# Altium schematic sheet [07] Communication.SchDoc
size A3
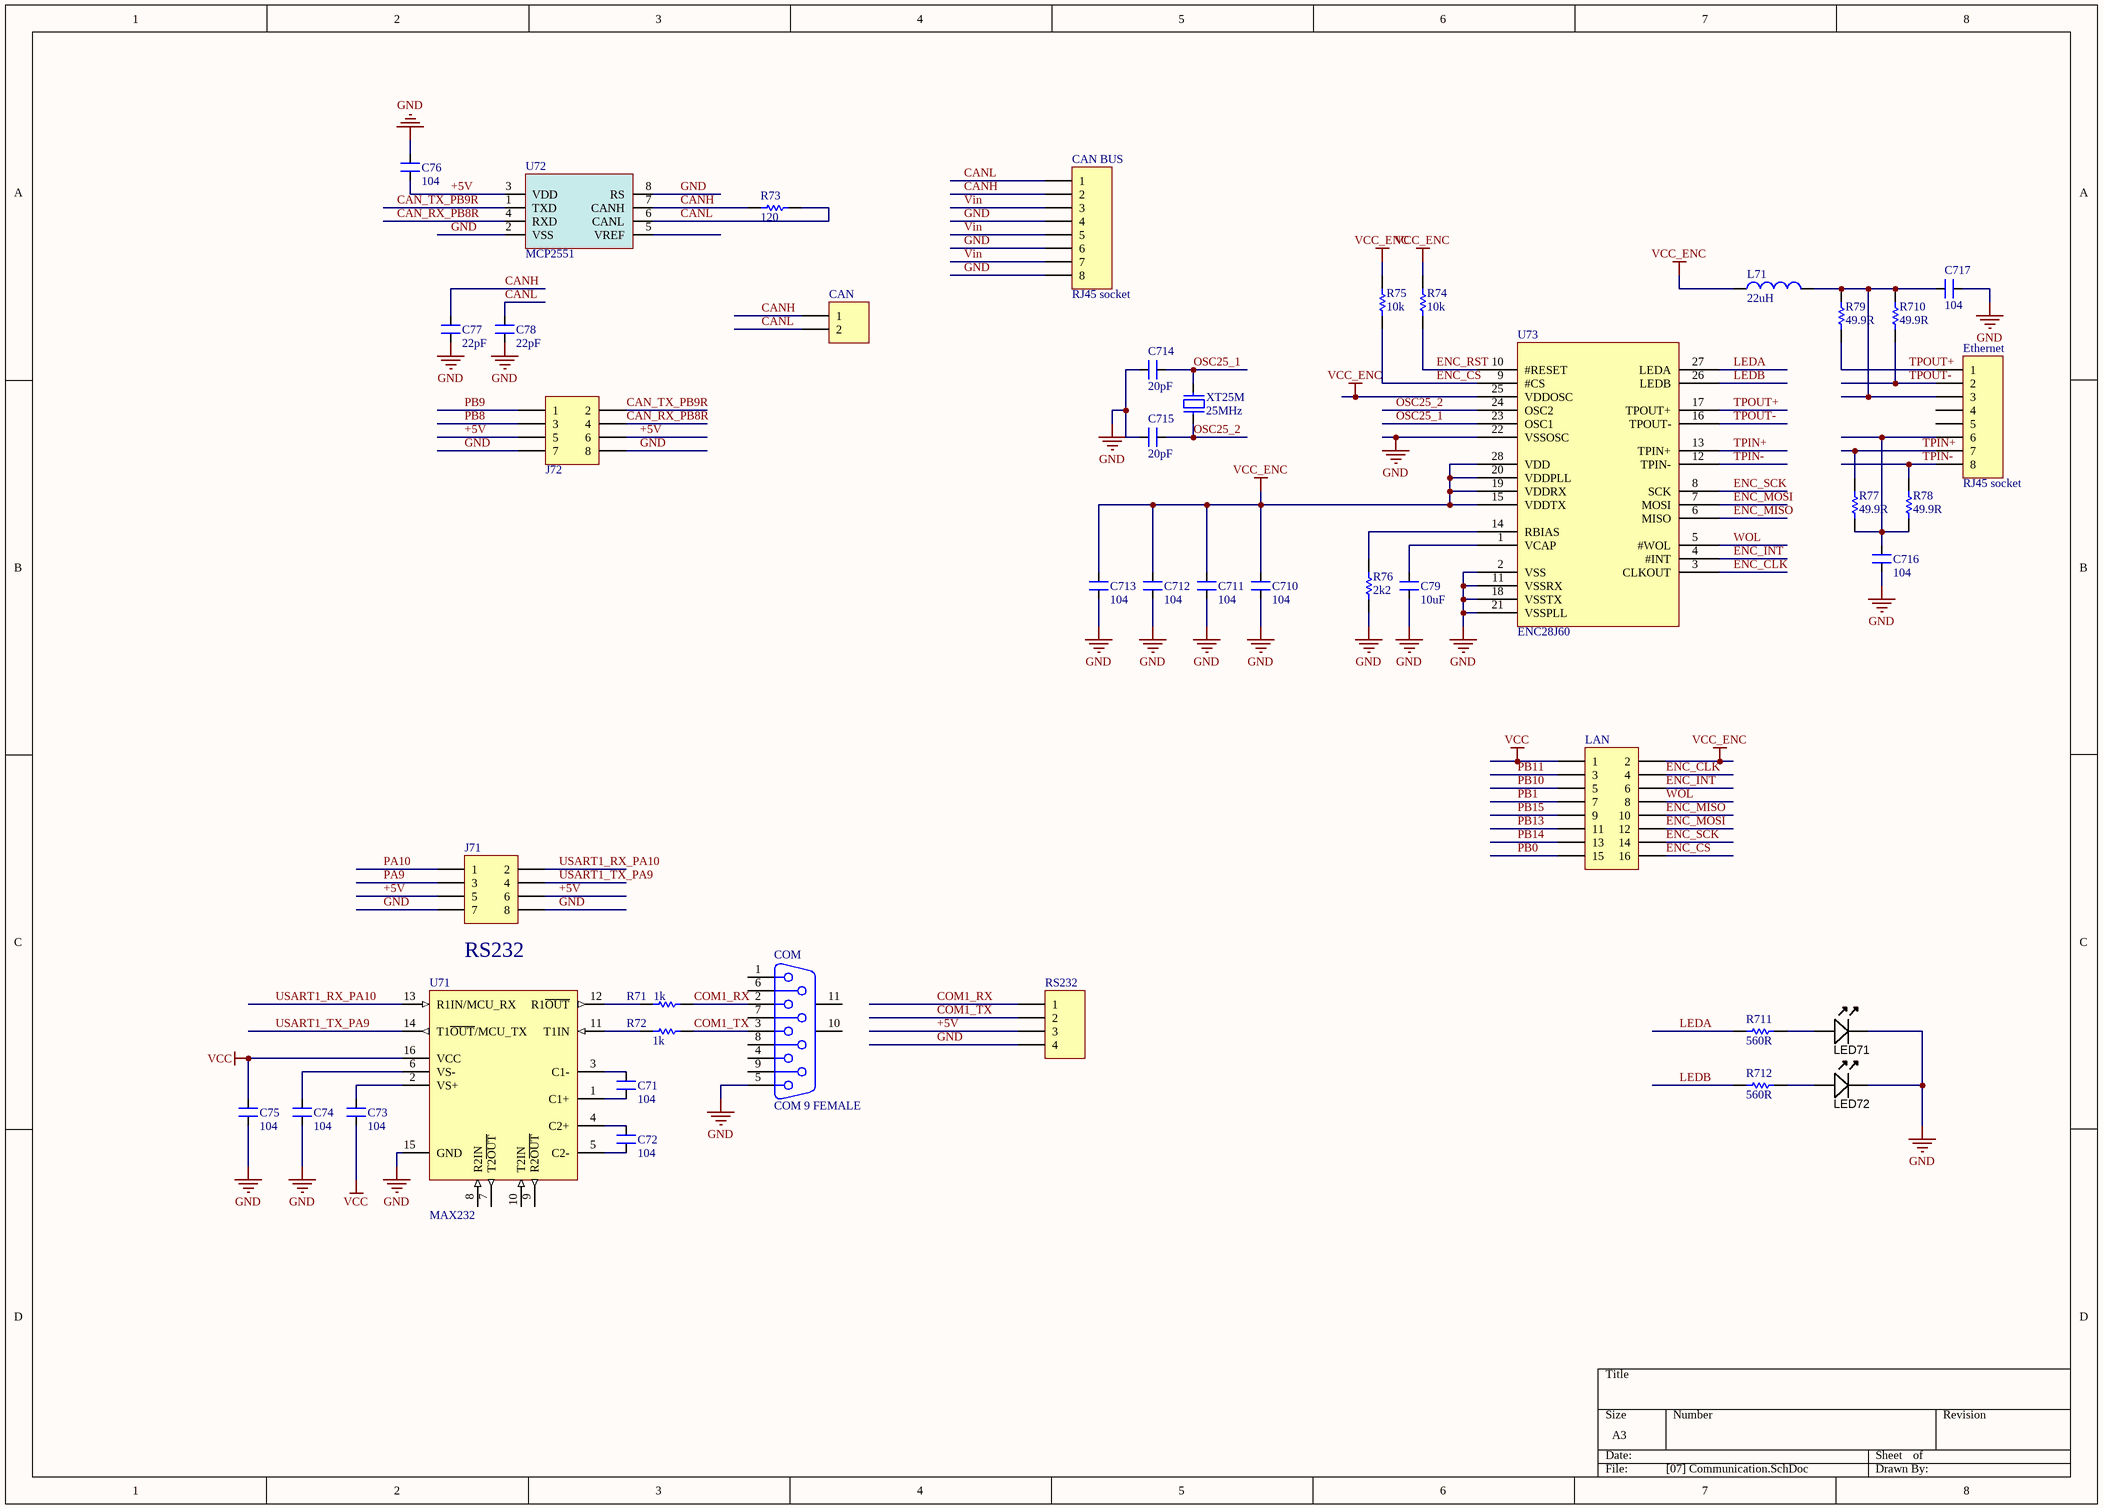
[diagram p0: [07] Communication.SchDoc]

## Parts
C71  value 104  [CAPC2012N_F]  (hidden comment: Cap_1206_104)
C72  value 104  [CAPC2012N_F]  (hidden comment: Cap_1206_104)
C73  value 104  [CAPC2012N_F]  (hidden comment: Cap_1206_104)
C74  value 104  [CAPC2012N_F]  (hidden comment: Cap_1206_104)
C75  value 104  [CAPC2012N_F]  (hidden comment: Cap_1206_104)
C76  value 104  [CAPC2012N_F]  (hidden comment: Cap_10uF_0805)
C77  value 22pF  [CAPC1608N]  (hidden comment: Cap_22p_0603)
C78  value 22pF  [CAPC1608N]  (hidden comment: Cap_22p_0603)
C79  value 10uF  [CAPC2012N_F]  (hidden comment: CAP NP)
C710  value 104  [CAPC1608N]  (hidden comment: CAP NP)
C711  value 104  [CAPC1608N]  (hidden comment: CAP NP)
C712  value 104  [CAPC1608N]  (hidden comment: CAP NP)
C713  value 104  [CAPC1608N]  (hidden comment: CAP NP)
C714  value 20pF  [CAPC1608N]  (hidden comment: Cap_22p_0603)
C715  value 20pF  [CAPC1608N]  (hidden comment: Cap_22p_0603)
C716  value 104  [CAPC2012N_F]  (hidden comment: CAP NP)
C717  value 104  [CAPC2012N_F]  (hidden comment: CAP NP)
CAN  Header 2  [HDR1X2]  (value not drawn)
CAN_BUS  RJ45 socket  [RJ45]
COM  COM 9 FEMALE  [DB 9 Female]
Ethernet  RJ45 socket  [RJ45]
J71  Header 4X2  [HDR2X4]  (value not drawn)
J72  Header 4X2  [HDR2X4]  (value not drawn)
L71  value 22uH  [CAPC2012N_F]  (hidden comment: Inductor)
LAN  Header 8X2  [HDR2X8]  (value not drawn)
LED71  Blue  [LED-0805-K]  (value not drawn)
LED72  Blue  [LED-0805-K]  (value not drawn)
R71  1k  [RESC2012N_F]
R72  1k  [RESC2012N_F]
R73  value 120  [RESC2012N_F]  (hidden comment: Res_120_0805)
R74  value 10k  [RESC1608N_ZERO]  (hidden comment: Res)
R75  value 10k  [RESC1608N_ZERO]  (hidden comment: Res)
R76  value 2k2  [RESC1608N_ZERO]  (hidden comment: Res)
R77  value 49.9R  [RESC2012N_F]  (hidden comment: Res)
R78  value 49.9R  [RESC2012N_F]  (hidden comment: Res)
R79  value 49.9R  [RESC2012N_F]  (hidden comment: Res)
R710  value 49.9R  [RESC2012N_F]  (hidden comment: Res)
R711  value 560R  [RESC1608N_ZERO]  (hidden comment: Res)
R712  value 560R  [RESC1608N_ZERO]  (hidden comment: Res)
RS232  Header 4  [HDR1X4]  (value not drawn)
U71  MAX232  [SOIC127P600X175-16AN]
U72  MCP2551  [SOIC 8]
U73  ENC28J60  [SOIC-28]
XT25M  25MHz  [XT2]

## Nets
GND: C74.1 C75.1 C76.1 C77.1 C78.1 C79.1 C710.1 C711.1 C712.1 C713.1 C714.2 C715.2 C716.1 C717.2 CAN_BUS.4 CAN_BUS.6 CAN_BUS.8 COM.5 J71.7 J71.8 J72.7 J72.8 LED71.K LED72.K R76.1 RS232.4 U71.15(GND) U72.2(VSS) U72.8(RS) U73.2(VSS) U73.11(VSSRX) U73.18(VSSTX) U73.21(VSSPLL) U73.22(VSSOSC)
VCC: C73.1 C75.2 LAN.1 U71.16(VCC)
VCC_ENC: C710.2 C711.2 C712.2 C713.2 L71.1 LAN.2 R74.2 R75.2 U73.15(VDDTX) U73.19(VDDRX) U73.20(VDDPLL) U73.25(VDDOSC) U73.28(VDD)
+5V: C76.2 J71.5 J71.6 J72.5 J72.6 RS232.3 U72.3(VDD)
CAN_RX_PB8R: J72.4 U72.4(RXD)
CAN_TX_PB9R: J72.2 U72.1(TXD)
CANH: C77.2 CAN.1 CAN_BUS.2 R73.1 U72.7(CANH)
CANL: C78.2 CAN.2 CAN_BUS.1 R73.2 U72.6(CANL)
COM1_RX: COM.2 R71.2 RS232.1
COM1_TX: COM.3 R72.2 RS232.2
ENC_CLK: LAN.4 U73.3(CLKOUT)
ENC_CS: LAN.16 R75.1 U73.9(#CS)
ENC_INT: LAN.6 U73.4(#INT)
ENC_MISO: LAN.10 U73.6(MISO)
ENC_MOSI: LAN.12 U73.7(MOSI)
ENC_RST: R74.1 U73.10(#RESET)
ENC_SCK: LAN.14 U73.8(SCK)
LEDA: R711.1 U73.27(LEDA)
LEDB: R712.1 U73.26(LEDB)
OSC25_1: C714.1 U73.23(OSC1) XT25M.2
OSC25_2: C715.1 U73.24(OSC2) XT25M.1
PA9: J71.3
PA10: J71.1
PB0: LAN.15
PB1: LAN.7
PB8: J72.3
PB9: J72.1
PB10: LAN.5
PB11: LAN.3
PB13: LAN.11
PB14: LAN.13
PB15: LAN.9
TPIN+: Ethernet.7 R77.2 U73.13(TPIN+)
TPIN-: Ethernet.8 R78.2 U73.12(TPIN-)
TPOUT+: Ethernet.1 R79.1 U73.17(TPOUT+)
TPOUT-: Ethernet.2 R710.1 U73.16(TPOUT-)
USART1_RX_PA10: J71.2 U71.13(R1IN/MCU_RX)
USART1_TX_PA9: J71.4 U71.14(T1~{OUT}/MCU_TX)
Vin: CAN_BUS.3 CAN_BUS.5 CAN_BUS.7
WOL: LAN.8 U73.5(#WOL)
NetC71_1: C71.1 U71.1(C1+)
NetC71_2: C71.2 U71.3(C1-)
NetC72_1: C72.1 U71.5(C2-)
NetC72_2: C72.2 U71.4(C2+)
NetC73_2: C73.2 U71.2(VS+)
NetC74_2: C74.2 U71.6(VS-)
NetC79_2: C79.2 U73.1(VCAP)
NetC716_2: C716.2 Ethernet.6 R77.1 R78.1
NetC717_1: C717.1 Ethernet.3 L71.2 R79.2 R710.2
NetLED71_A: LED71.A R711.2
NetLED72_A: LED72.A R712.2
NetR71_1: R71.1 U71.12(R1~{OUT})
NetR72_1: R72.1 U71.11(T1IN)
NetR76_2: R76.2 U73.14(RBIAS)

Not connected (* = marked no-connect by the designer): COM 1 4 6 7 8 9 10(MH1) 11(MH2); Ethernet 4 5; U71 7(T2~{OUT}) 8(R2IN) 9(R2~{OUT}) 10(T2IN); U72 5(VREF)

## Notes on the sheet
- RS232

## Library data of the parts
C71-C78 C714 C715 = CAP NP
CAN = Header 2: Header, 2-Pin; LatestRevisionDate: 17-Jul-2002; LatestRevisionNote: Re-released for DXP Platform.; Publisher: Altium Limited
CAN_BUS Ethernet = Header 8: Header, 8-Pin; LatestRevisionDate: 17-Jul-2002; LatestRevisionNote: Re-released for DXP Platform.; Publisher: Altium Limited
COM = COM9M: PackageDocument: O; Positions: 9; Gender: Receptacle; Value: COM 9; Published: 15-Jun-2001; LatestRevisionDate: 17-Jul-2002; LatestRevisionNote: Re-released for DXP Platform.; DatasheetDocument: 1-Sep-1999; PackageReference: 788750; Publisher: Altium Limited; Orientation: Right Angle
J71 J72 = Header 4X2: Header, 4-Pin, Dual row; LatestRevisionDate: 17-Jul-2002; LatestRevisionNote: Re-released for DXP Platform.; Publisher: Altium Limited
LAN = Header 8X2: Header, 8-Pin, Dual row; LatestRevisionDate: 17-Jul-2002; LatestRevisionNote: Re-released for DXP Platform.; Publisher: Altium Limited
LED71 LED72 = LED_SMD_Blue_0805_100mcd: LED 0805 SMD Blue 100mcd 470nm; Manufacturer 1: Ligitek; Manufacturer Part Number 1: LG-170DBKZ-CT; Material: InGaN/GaN; Ratings: 100 mcd; 470 nm; Package / Case: 0805; Value: Blue; Color: Blue
R71 R72 = Res: Tro dan 1k; Value: 1k
R73 = Res
RS232 = Header 4: Header, 4-Pin; LatestRevisionDate: 17-Jul-2002; LatestRevisionNote: Re-released for DXP Platform.; Publisher: Altium Limited
XT25M = Crystal